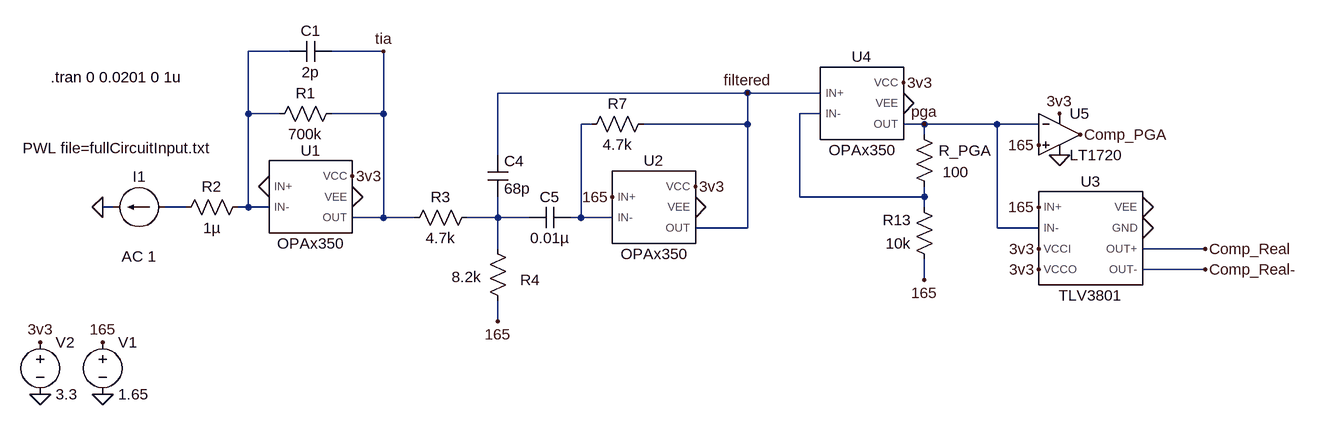
[diagram p0: schematic circuitR.asc]
circuitR.asc, the LTspice schematic file:
Version 4.1
SHEET 1 3920 1676
WIRE 2352 800 2288 800
WIRE 2496 800 2416 800
WIRE 3056 864 2672 864
WIRE 3168 864 3056 864
WIRE 2288 896 2288 800
WIRE 2336 896 2288 896
WIRE 2496 896 2496 800
WIRE 2496 896 2416 896
WIRE 3168 896 3136 896
WIRE 2816 912 2800 912
WIRE 3056 912 3056 864
WIRE 3056 912 2896 912
WIRE 3328 912 3296 912
WIRE 3440 912 3328 912
WIRE 3504 912 3440 912
WIRE 3328 928 3328 912
WIRE 2672 960 2672 864
WIRE 3136 1024 3136 896
WIRE 3328 1024 3328 1008
WIRE 3328 1024 3136 1024
WIRE 2080 1040 2064 1040
WIRE 2192 1040 2160 1040
WIRE 2288 1040 2288 896
WIRE 2288 1040 2272 1040
WIRE 2320 1040 2288 1040
WIRE 3328 1040 3328 1024
WIRE 2496 1056 2496 896
WIRE 2496 1056 2448 1056
WIRE 2544 1056 2496 1056
WIRE 2672 1056 2672 1024
WIRE 2672 1056 2624 1056
WIRE 2720 1056 2672 1056
WIRE 2800 1056 2800 912
WIRE 2800 1056 2784 1056
WIRE 2848 1056 2800 1056
WIRE 3056 1072 3056 912
WIRE 3056 1072 2976 1072
WIRE 3440 1072 3440 912
WIRE 3504 1072 3440 1072
WIRE 2672 1104 2672 1056
WIRE 3760 1104 3664 1104
WIRE 3760 1136 3664 1136
WIRE 3328 1152 3328 1120
WIRE 2672 1216 2672 1184
FLAG 2448 992 3v3
FLAG 2448 1024 0
FLAG 2064 1040 0
FLAG 2976 1008 3v3
FLAG 2976 1040 0
FLAG 3056 864 filtered
FLAG 2064 1328 0
FLAG 1968 1328 0
FLAG 1968 1248 3v3
FLAG 2064 1248 165
FLAG 2672 1216 165
FLAG 2848 1024 165
FLAG 3296 848 3v3
FLAG 3296 880 0
FLAG 3328 1152 165
FLAG 3504 944 165
FLAG 3536 896 3v3
FLAG 3536 960 0
FLAG 3568 928 Comp_PGA
FLAG 2320 1008 0
FLAG 3328 912 pga
FLAG 2496 800 tia
FLAG 3504 1040 165
FLAG 3504 1104 3v3
FLAG 3504 1136 3v3
FLAG 3664 1040 0
FLAG 3664 1072 0
FLAG 3760 1104 Comp_Real
FLAG 3760 1136 Comp_Real-
SYMBOL res 2432 880 R90
WINDOW 0 0 56 VBottom 2
WINDOW 3 32 56 VTop 2
SYMATTR InstName R1
SYMATTR Value 700k
SYMBOL cap 2416 784 R90
WINDOW 0 0 32 VBottom 2
WINDOW 3 32 32 VTop 2
SYMATTR InstName C1
SYMATTR Value 2p
SYMBOL res 2288 1024 R90
WINDOW 0 0 56 VBottom 2
WINDOW 3 32 56 VTop 2
SYMATTR InstName R2
SYMATTR Value 1µ
SYMBOL current 2160 1040 R90
WINDOW 0 -32 40 VBottom 2
WINDOW 3 -107 75 VTop 2
WINDOW 123 60 40 VTop 2
WINDOW 39 0 0 Left 0
SYMATTR InstName I1
SYMATTR Value PWL file=fullCircuitInput.txt
SYMATTR Value2 AC 1
SYMBOL LTSpiceModels\\sbom071e\\OPAx350 2384 1024 R0
SYMATTR InstName U1
SYMBOL res 2640 1040 R90
WINDOW 0 0 56 VBottom 2
WINDOW 3 32 56 VTop 2
SYMATTR InstName R3
SYMATTR Value 4.7k
SYMBOL res 2688 1200 R180
WINDOW 0 -49 48 Left 2
WINDOW 3 41 53 Left 2
SYMATTR InstName R4
SYMATTR Value 8.2k
SYMBOL cap 2656 960 R0
WINDOW 0 26 9 Left 2
WINDOW 3 26 51 Left 2
SYMATTR InstName C4
SYMATTR Value 68p
SYMBOL cap 2784 1040 R90
WINDOW 0 0 32 VBottom 2
WINDOW 3 32 32 VTop 2
SYMATTR InstName C5
SYMATTR Value 0.01µ
SYMBOL res 2912 896 R90
WINDOW 0 0 56 VBottom 2
WINDOW 3 32 56 VTop 2
SYMATTR InstName R7
SYMATTR Value 4.7k
SYMBOL LTSpiceModels\\sbom071e\\OPAx350 2912 1040 R0
SYMATTR InstName U2
SYMBOL voltage 2064 1232 R0
WINDOW 123 0 0 Left 0
WINDOW 39 0 0 Left 0
SYMATTR InstName V1
SYMATTR Value 1.65
SYMBOL voltage 1968 1232 R0
WINDOW 123 0 0 Left 0
WINDOW 39 0 0 Left 0
SYMATTR InstName V2
SYMATTR Value 3.3
SYMBOL LTSpiceModels\\sbom071e\\OPAx350 3232 880 R0
SYMATTR InstName U4
SYMBOL res 3344 1024 R180
WINDOW 0 -87 71 Left 2
WINDOW 3 -53 38 Left 2
SYMATTR InstName R_PGA
SYMATTR Value 100
SYMBOL res 3344 1136 R180
WINDOW 0 36 76 Left 2
WINDOW 3 36 40 Left 2
SYMATTR InstName R13
SYMATTR Value 10k
SYMBOL Comparators\\LT1720 3536 864 R0
SYMATTR InstName U5
SYMBOL LTSpiceModels\\snom740a\\TLV3801v3\\TLV3801 3584 1088 R0
SYMATTR InstName U3
TEXT 1984 840 Left 2 !.tran 0 0.0201 0 1u

The netlist it stands for:
* circuitR.asc
R1 tia N001 700k
C1 tia N001 2p
R2 N001 N004 1µ
I1 N004 0 PWL file=fullCircuitInput.txt AC 1
X§U1 0 N001 3v3 0 tia OPAx350  ; pins IN+ IN- VCC VEE OUT
R3 N005 tia 4.7k
R4 165 N005 8.2k
C4 filtered N005 68p
C5 N003 N005 0.01µ
R7 filtered N003 4.7k
X§U2 165 N003 3v3 0 filtered OPAx350  ; pins IN+ IN- VCC VEE OUT
V1 165 0 1.65
V2 3v3 0 3.3
X§U4 filtered N002 3v3 0 pga OPAx350  ; pins IN+ IN- VCC VEE OUT
R_PGA N002 pga 100
R13 165 N002 10k
X§U5 165 pga 3v3 0 Comp_PGA LT1720  ; pins In+ In- V+ V- OUT
X§U3 165 pga 3v3 3v3 0 0 Comp_Real Comp_Real- TLV3801  ; pins IN+ IN- VCCI VCCO VEE GND OUT+ OUT-
.tran 0 0.0201 0 1u
.lib C:\Users\jpulu\OneDrive\Área de Trabalho\TCC\LTSpiceModels\sbom071e\OPAx350.LIB
.lib LT1720.sub
.lib C:\Users\jpulu\OneDrive\Área de Trabalho\TCC\LTSpiceModels\snom740a\TLV3801v3\tlv3801.lib
.backanno
.end